# Altium project eeg.PrjPcb
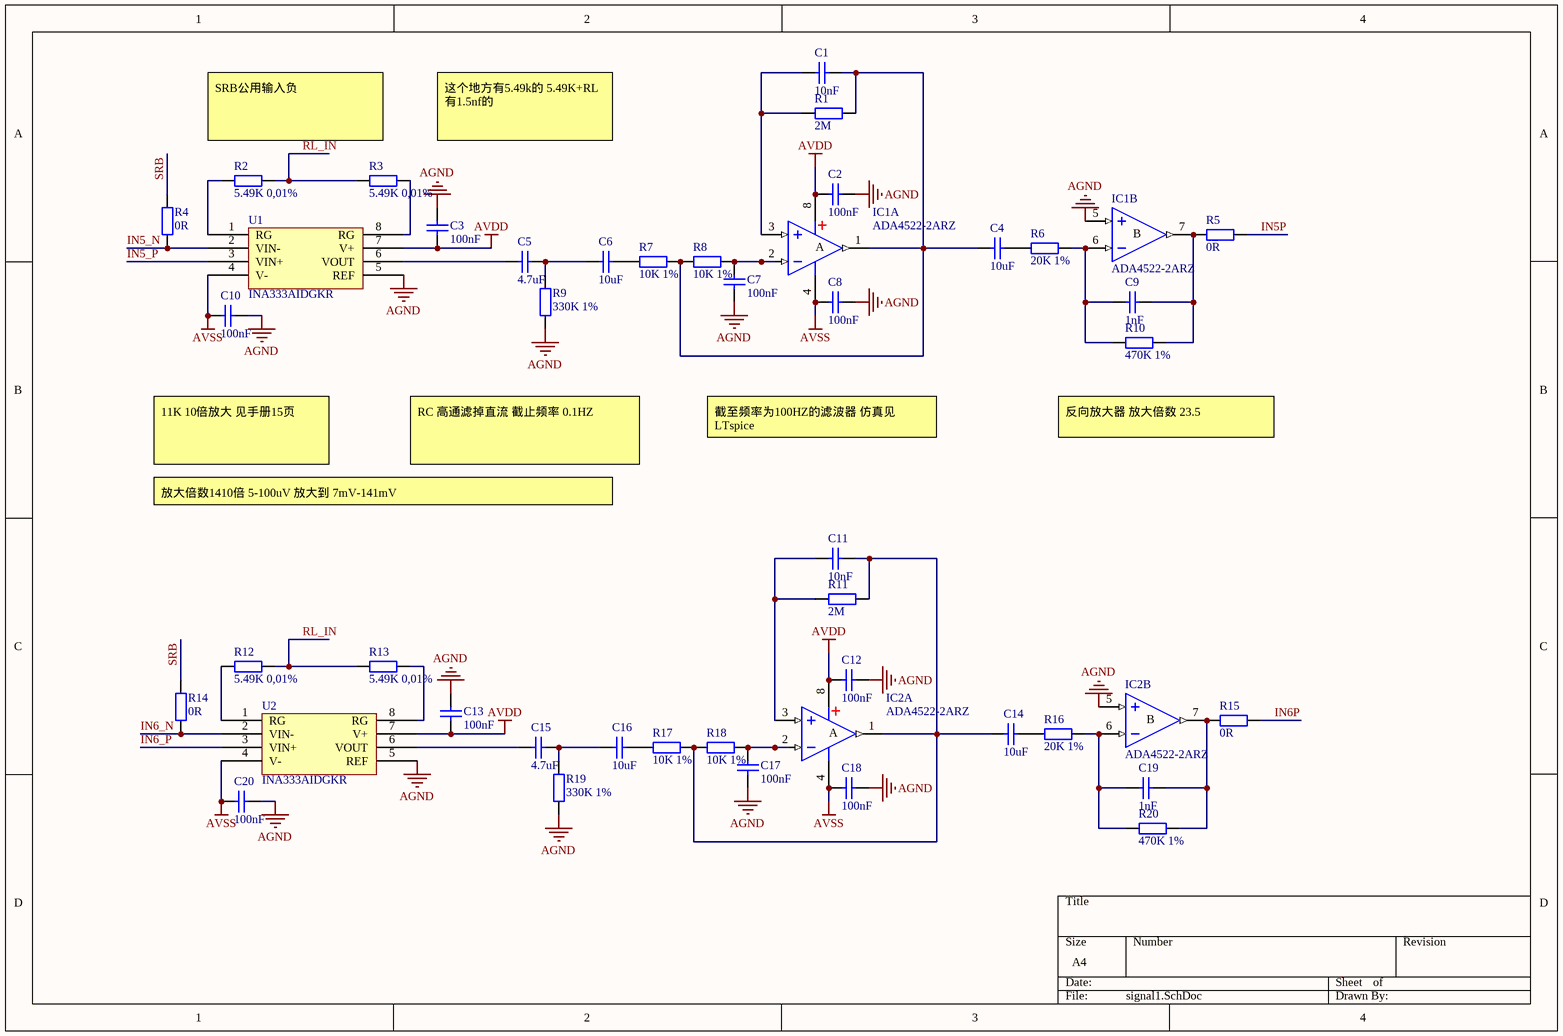
[diagram p0: signal1.SchDoc]
4 sheets, 143 parts. Net scope: global (net labels, ports and power ports of the same name join across sheets).
Board file: eeg.PcbDoc
Sheets:
  signal1.SchDoc
  signal2.SchDoc
  signal3.SchDoc
  power_ic.SchDoc

## Sheet signal1.SchDoc
size A4; SheetNumber: 1; SheetTotal: 6

### Parts
C1  10nF  [C0603_L]
C2  100nF  [C0603_L]
C3  100nF  [C0603_L]
C4  10uF  [C0603_L]
C5  4.7uF  [C0603_L]
C6  10uF  [C0603_L]
C7  100nF  [C0603_L]
C8  100nF  [C0603_L]
C9  1nF  [C0603_L]
C10  100nF  [C0603_L]
C11  10nF  [C0603_L]
C12  100nF  [C0603_L]
C13  100nF  [C0603_L]
C14  10uF  [C0603_L]
C15  4.7uF  [C0603_L]
C16  10uF  [C0603_L]
C17  100nF  [C0603_L]
C18  100nF  [C0603_L]
C19  1nF  [C0603_L]
C20  100nF  [C0603_L]
IC1  ADA4522-2ARZ  [SOIC-8]  (parts A,B of 2)
IC2  ADA4522-2ARZ  [SOIC-8]  (parts A,B of 2)
R1  2M  [R0603_L]
R2  5.49K 0,01%  [R0603_M]
R3  5.49K 0,01%  [R0603_M]
R4  0R  [R0603_L]
R5  0R  [R0603_L]
R6  20K 1%  [R0603_L]
R7  10K 1%  [R0603_L]
R8  10K 1%  [R0603_L]
R9  330K 1%  [R0603_L]
R10  470K 1%  [R0603_L]
R11  2M  [R0603_L]
R12  5.49K 0,01%  [R0603_M]
R13  5.49K 0,01%  [R0603_M]
R14  0R  [R0603_L]
R15  0R  [R0603_L]
R16  20K 1%  [R0603_L]
R17  10K 1%  [R0603_L]
R18  10K 1%  [R0603_L]
R19  330K 1%  [R0603_L]
R20  470K 1%  [R0603_L]
U1  INA333AIDGKR  [MSOP8_N]
U2  INA333AIDGKR  [MSOP8_N]

### Nets
AGND: C2.2 C3.1 C7.1 C8.2 C10.1 C12.2 C13.1 C17.1 C18.2 C20.1 IC1.5(IN+) IC2.5(IN+) R9.1 R19.1 U1.5(REF) U2.5(REF)
AVDD: C2.1 C3.2 C12.1 C13.2 IC1.8(V+) IC2.8(V+) U1.7(V+) U2.7(V+)
AVSS: C8.1 C10.2 C18.1 C20.2 IC1.4(V-) IC2.4(V-) U1.4(V-) U2.4(V-)
IN5_N: R4.2 U1.2(VIN-)
IN5_P: U1.3(VIN+)
IN5P: R5.1
IN6_N: R14.2 U2.2(VIN-)
IN6_P: U2.3(VIN+)
IN6P: R15.1
RL_IN: R2.2 R3.1 R12.2 R13.1
SRB: R4.1 R14.1
NetC1_1: C1.1 IC1.3(IN+) R1.2
NetC1_2: C1.2 C4.1 IC1.1(OUT) R1.1 R7.1 R8.2
NetC4_2: C4.2 R6.2
NetC5_1: C5.1 U1.6(VOUT)
NetC5_2: C5.2 C6.1 R9.2
NetC6_2: C6.2 R7.2
NetC7_2: C7.2 IC1.2(IN-) R8.1
NetC9_1: C9.1 IC1.6(IN-) R6.1 R10.2
NetC9_2: C9.2 IC1.7(OUT) R5.2 R10.1
NetC11_1: C11.1 IC2.3(IN+) R11.2
NetC11_2: C11.2 C14.1 IC2.1(OUT) R11.1 R17.1 R18.2
NetC14_2: C14.2 R16.2
NetC15_1: C15.1 U2.6(VOUT)
NetC15_2: C15.2 C16.1 R19.2
NetC16_2: C16.2 R17.2
NetC17_2: C17.2 IC2.2(IN-) R18.1
NetC19_1: C19.1 IC2.6(IN-) R16.1 R20.2
NetC19_2: C19.2 IC2.7(OUT) R15.2 R20.1
NetR2_1: R2.1 U1.1(RG)
NetR3_2: R3.2 U1.8(RG)
NetR12_1: R12.1 U2.1(RG)
NetR13_2: R13.2 U2.8(RG)

### Notes on the sheet
- SRB公用输入负
- 这个地方有5.49k的 5.49K+RL 有1.5nf的
- 截至频率为100HZ的滤波器 仿真见LTspice
- 反向放大器 放大倍数 23.5
- 11K 10倍放大 见手册15页
- 放大倍数1410倍 5-100uV 放大到 7mV-141mV
- RC 高通滤掉直流 截止频率 0.1HZ
- (in symbol ADA4522-2ARZ, part A) A
- (in symbol ADA4522-2ARZ, part B) B

### Library data of the parts
C1-C20 = C: 贴片电容/MLCC电容; BOM名称: 无极性贴片电容; 联系下单店铺卖家 免费帮你查找封装: 联系下单店铺卖家 免费技术指导
IC1 IC2 = ADA4522-2ARZ: 双通道55V、EMI增强型、零漂移、超低噪声、RRO运算放大器; BOM名称: 双路运放; 封装库来自淘宝卖家：黄晶宝石: 其他店铺购入均为赃物，无售后更新权益，请立即申请退款，退款后现金奖励200~1000元; jlc_id: C403697
R1-R20 = R: 贴片电阻; 联系下单店铺卖家 免费帮你查找封装: 联系下单店铺卖家 免费技术指导; BOM名称: 贴片电阻
U1 U2 = INA333AIDGKR: INA333 低功耗、零漂移、精密仪表放大器; jlc_id: C19450

## Sheet signal2.SchDoc
size A4; SheetNumber: 2; SheetTotal: 6
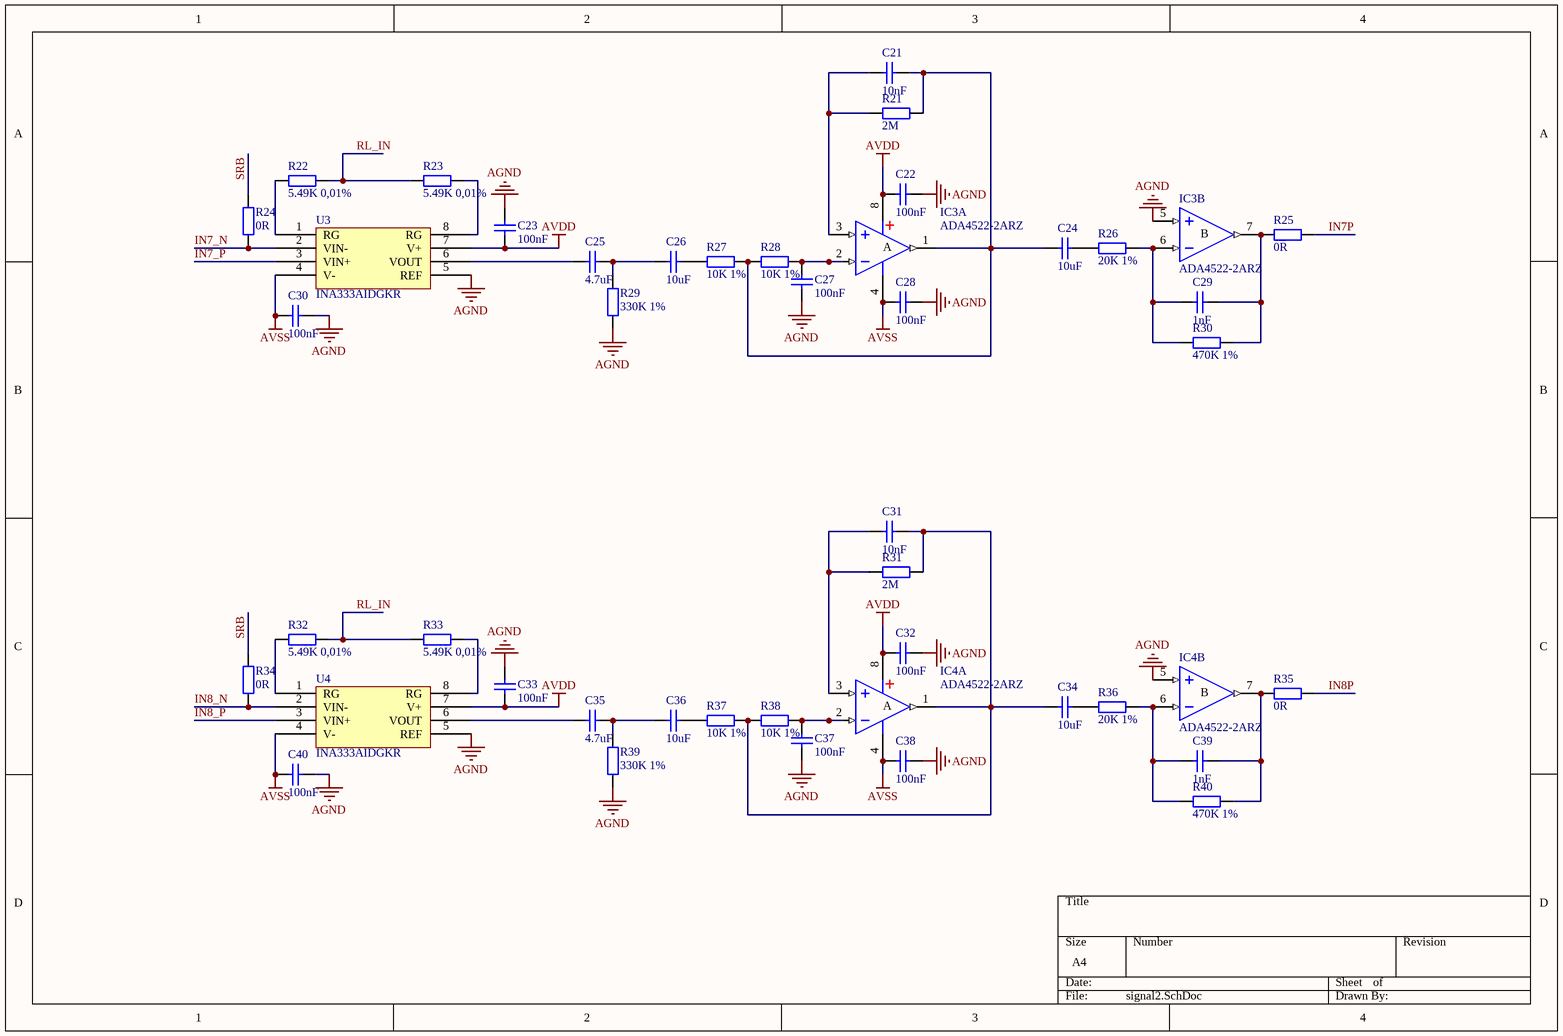
[diagram p1: signal2.SchDoc]

### Parts
C21  10nF  [C0603_L]
C22  100nF  [C0603_L]
C23  100nF  [C0603_L]
C24  10uF  [C0603_L]
C25  4.7uF  [C0603_L]
C26  10uF  [C0603_L]
C27  100nF  [C0603_L]
C28  100nF  [C0603_L]
C29  1nF  [C0603_L]
C30  100nF  [C0603_L]
C31  10nF  [C0603_L]
C32  100nF  [C0603_L]
C33  100nF  [C0603_L]
C34  10uF  [C0603_L]
C35  4.7uF  [C0603_L]
C36  10uF  [C0603_L]
C37  100nF  [C0603_L]
C38  100nF  [C0603_L]
C39  1nF  [C0603_L]
C40  100nF  [C0603_L]
IC3  ADA4522-2ARZ  [SOIC-8]  (parts A,B of 2)
IC4  ADA4522-2ARZ  [SOIC-8]  (parts A,B of 2)
R21  2M  [R0603_L]
R22  5.49K 0,01%  [R0603_M]
R23  5.49K 0,01%  [R0603_M]
R24  0R  [R0603_L]
R25  0R  [R0603_L]
R26  20K 1%  [R0603_L]
R27  10K 1%  [R0603_L]
R28  10K 1%  [R0603_L]
R29  330K 1%  [R0603_L]
R30  470K 1%  [R0603_L]
R31  2M  [R0603_L]
R32  5.49K 0,01%  [R0603_M]
R33  5.49K 0,01%  [R0603_M]
R34  0R  [R0603_L]
R35  0R  [R0603_L]
R36  20K 1%  [R0603_L]
R37  10K 1%  [R0603_L]
R38  10K 1%  [R0603_L]
R39  330K 1%  [R0603_L]
R40  470K 1%  [R0603_L]
U3  INA333AIDGKR  [MSOP8_N]
U4  INA333AIDGKR  [MSOP8_N]

### Nets
AGND: C22.2 C23.1 C27.1 C28.2 C30.1 C32.2 C33.1 C37.1 C38.2 C40.1 IC3.5(IN+) IC4.5(IN+) R29.1 R39.1 U3.5(REF) U4.5(REF)
AVDD: C22.1 C23.2 C32.1 C33.2 IC3.8(V+) IC4.8(V+) U3.7(V+) U4.7(V+)
AVSS: C28.1 C30.2 C38.1 C40.2 IC3.4(V-) IC4.4(V-) U3.4(V-) U4.4(V-)
IN7_N: R24.2 U3.2(VIN-)
IN7_P: U3.3(VIN+)
IN7P: R25.1
IN8_N: R34.2 U4.2(VIN-)
IN8_P: U4.3(VIN+)
IN8P: R35.1
RL_IN: R22.2 R23.1 R32.2 R33.1
SRB: R24.1 R34.1
NetC21_1: C21.1 IC3.3(IN+) R21.2
NetC21_2: C21.2 C24.1 IC3.1(OUT) R21.1 R27.1 R28.2
NetC24_2: C24.2 R26.2
NetC25_1: C25.1 U3.6(VOUT)
NetC25_2: C25.2 C26.1 R29.2
NetC26_2: C26.2 R27.2
NetC27_2: C27.2 IC3.2(IN-) R28.1
NetC29_1: C29.1 IC3.6(IN-) R26.1 R30.2
NetC29_2: C29.2 IC3.7(OUT) R25.2 R30.1
NetC31_1: C31.1 IC4.3(IN+) R31.2
NetC31_2: C31.2 C34.1 IC4.1(OUT) R31.1 R37.1 R38.2
NetC34_2: C34.2 R36.2
NetC35_1: C35.1 U4.6(VOUT)
NetC35_2: C35.2 C36.1 R39.2
NetC36_2: C36.2 R37.2
NetC37_2: C37.2 IC4.2(IN-) R38.1
NetC39_1: C39.1 IC4.6(IN-) R36.1 R40.2
NetC39_2: C39.2 IC4.7(OUT) R35.2 R40.1
NetR22_1: R22.1 U3.1(RG)
NetR23_2: R23.2 U3.8(RG)
NetR32_1: R32.1 U4.1(RG)
NetR33_2: R33.2 U4.8(RG)

### Notes on the sheet
- (in symbol ADA4522-2ARZ, part A) A
- (in symbol ADA4522-2ARZ, part B) B

### Library data of the parts
C21-C40 = C: as C1 on sheet signal1
IC3 IC4 = ADA4522-2ARZ: as IC1 on sheet signal1; jlc_id: C403697
R21-R40 = R: 贴片电阻; 联系下单店铺卖家 免费帮你查找封装: 联系下单店铺卖家 免费技术指导; BOM名称: 贴片电阻
U3 U4 = INA333AIDGKR: INA333 低功耗、零漂移、精密仪表放大器; jlc_id: C19450

## Sheet signal3.SchDoc
size A4; SheetNumber: 3; SheetTotal: 6
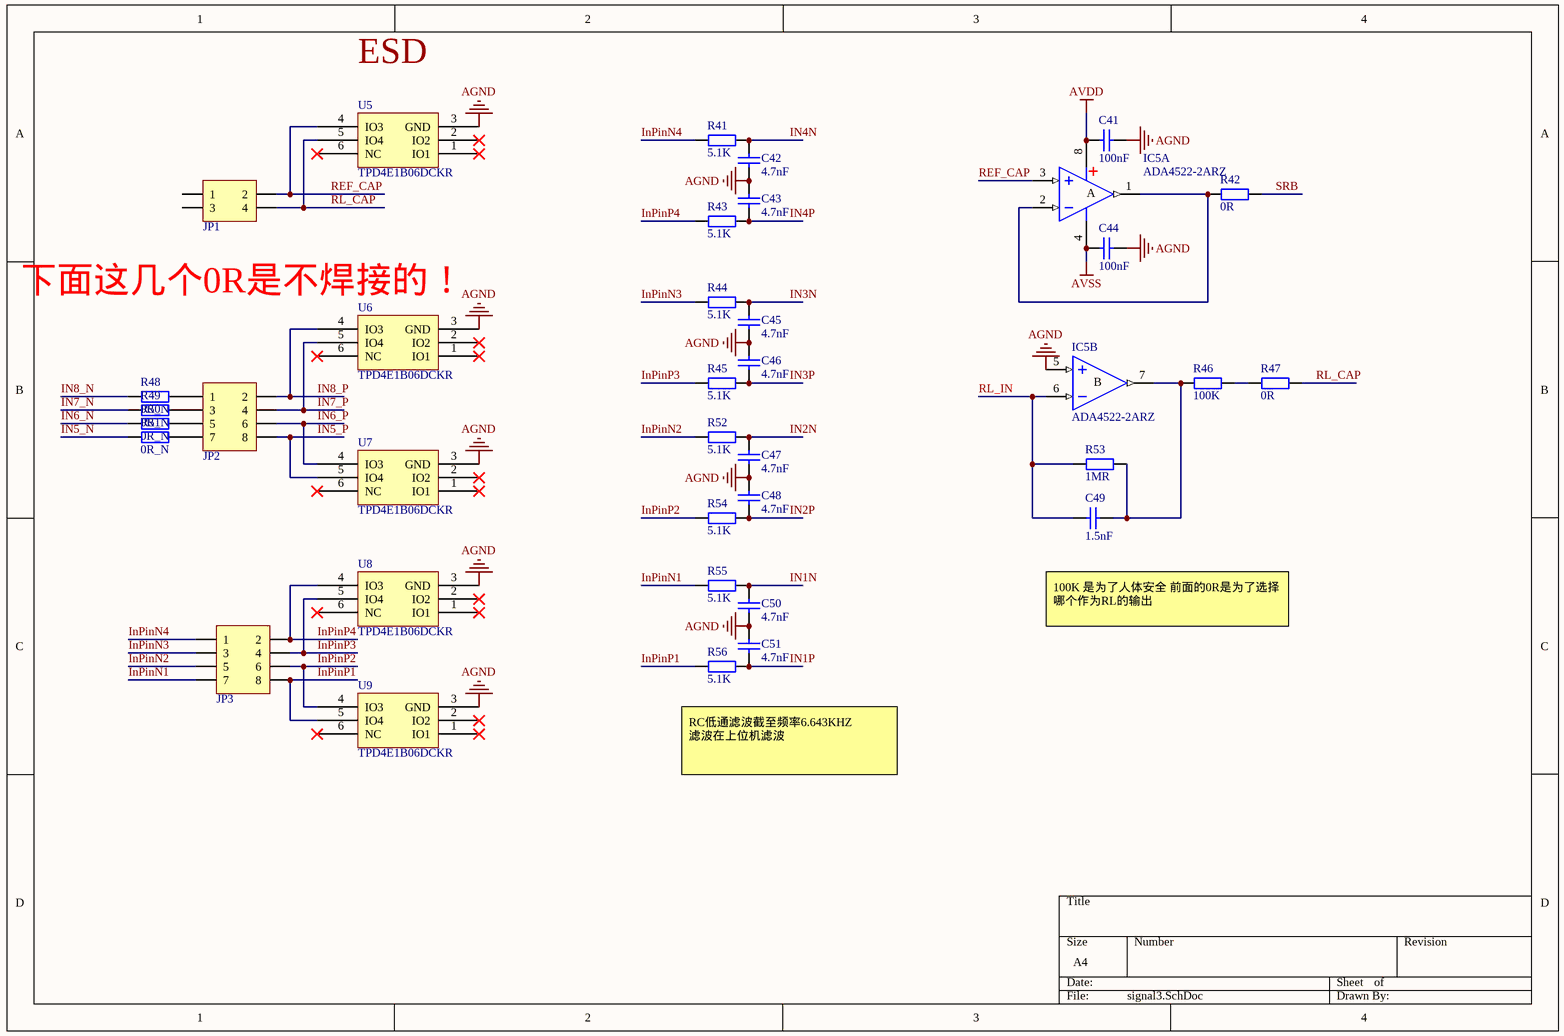
[diagram p2: signal3.SchDoc]

### Parts
C41  100nF  [C0603_L]
C42  4.7nF  [C0603_L]
C43  4.7nF  [C0603_L]
C44  100nF  [C0603_L]
C45  4.7nF  [C0603_L]
C46  4.7nF  [C0603_L]
C47  4.7nF  [C0603_L]
C48  4.7nF  [C0603_L]
C49  1.5nF  [C0603_L]
C50  4.7nF  [C0603_L]
C51  4.7nF  [C0603_L]
IC5  ADA4522-2ARZ  [SOIC-8]  (parts A,B of 2)
JP1  Header2X2  [HDR2.54-WI-2x2P]  (value not drawn)
JP2  Header 4X2  [HDR2.54-WI-2x4P]  (value not drawn)
JP3  Header 4X2  [HDR2.54-WI-2x4P]  (value not drawn)
R41  5.1K  [R0603_L]
R42  0R  [R0603_L]
R43  5.1K  [R0603_L]
R44  5.1K  [R0603_L]
R45  5.1K  [R0603_L]
R46  100K  [R0603_L]
R47  0R  [R0603_L]
R48  0R_N  [R0603_L]
R49  0R_N  [R0603_L]
R50  0R_N  [R0603_L]
R51  0R_N  [R0603_L]
R52  5.1K  [R0603_L]
R53  1MR  [R0603_L]
R54  5.1K  [R0603_L]
R55  5.1K  [R0603_L]
R56  5.1K  [R0603_L]
U5  TPD4E1B06DCKR  [SOT363_N]
U6  TPD4E1B06DCKR  [SOT363_N]
U7  TPD4E1B06DCKR  [SOT363_N]
U8  TPD4E1B06DCKR  [SOT363_N]
U9  TPD4E1B06DCKR  [SOT363_N]

### Nets
AGND: C41.2 C42.1 C43.2 C44.2 C45.1 C46.2 C47.1 C48.2 C50.1 C51.2 IC5.5(IN+) U5.3(GND) U6.3(GND) U7.3(GND) U8.3(GND) U9.3(GND)
AVDD: C41.1 IC5.8(V+)
AVSS: C44.1 IC5.4(V-)
IN1N: C50.2 R55.2
IN1P: C51.1 R56.2
IN2N: C47.2 R52.2
IN2P: C48.1 R54.2
IN3N: C45.2 R44.2
IN3P: C46.1 R45.2
IN4N: C42.2 R41.2
IN4P: C43.1 R43.2
IN5_N: R51.2
IN5_P: JP2.8 U7.5(IO4)
IN6_N: R50.2
IN6_P: JP2.6 U7.4(IO3)
IN7_N: R49.2
IN7_P: JP2.4 U6.5(IO4)
IN8_N: R48.2
IN8_P: JP2.2 U6.4(IO3)
InPinN1: JP3.7 R55.1
InPinN2: JP3.5 R52.1
InPinN3: JP3.3 R44.1
InPinN4: JP3.1 R41.1
InPinP1: JP3.8 R56.1 U9.5(IO4)
InPinP2: JP3.6 R54.1 U9.4(IO3)
InPinP3: JP3.4 R45.1 U8.5(IO4)
InPinP4: JP3.2 R43.1 U8.4(IO3)
REF_CAP: IC5.3(IN+) JP1.2 U5.4(IO3)
RL_CAP: JP1.4 R47.1 U5.5(IO4)
RL_IN: C49.1 IC5.6(IN-) R53.2
SRB: R42.1
NetC49_2: C49.2 IC5.7(OUT) R46.2 R53.1
NetIC5_1: IC5.1(OUT) IC5.2(IN-) R42.2
NetJP2_1: JP2.1 R48.1
NetJP2_3: JP2.3 R49.1
NetJP2_5: JP2.5 R50.1
NetJP2_7: JP2.7 R51.1
NetR46_1: R46.1 R47.2

Not connected (* = marked no-connect by the designer): JP1 1 3; U5 1(IO1)* 2(IO2)* 6(NC)*; U6 1(IO1)* 2(IO2)* 6(NC)*; U7 1(IO1)* 2(IO2)* 6(NC)*; U8 1(IO1)* 2(IO2)* 6(NC)*; U9 1(IO1)* 2(IO2)* 6(NC)*

### Notes on the sheet
- ESD
- 下面这几个0R是不焊接的！
- 100K 是为了人体安全 前面的0R是为了选择哪个作为RL的输出
- RC低通滤波截至频率6.643KHZ
  滤波在上位机滤波
- (in symbol ADA4522-2ARZ, part A) A
- (in symbol ADA4522-2ARZ, part B) B

### Library data of the parts
C41-C51 = C: as C1 on sheet signal1
IC5 = ADA4522-2ARZ: as IC1 on sheet signal1; jlc_id: C403697
JP1 = Header 2X2: 2*2P接插件; 联系卖家，免费查找封装: 唯一出售店铺网址https://shop463601444.taobao.com; 封装库来自淘宝卖家ID：黄晶宝石: 其他店铺购入均为盗版封装库，请立即申请退款，本店现金奖励50~200元; BOM名称: 2*2P接插件
JP2 JP3 = Header 4X2: 4*2P接插件; 联系卖家，免费查找封装: 唯一出售店铺网址https://shop463601444.taobao.com; 封装库来自淘宝卖家ID：黄晶宝石: 其他店铺购入均为盗版封装库，请立即申请退款，本店现金奖励50~200元; BOM名称: 4*2P接插件
R41-R56 = R: 贴片电阻; 联系下单店铺卖家 免费帮你查找封装: 联系下单店铺卖家 免费技术指导; BOM名称: 贴片电阻
U5-U9 = TPD4E1B06DCKR: 具有 0.5nA 最大泄漏电流的四路 0.7pF、±5.5V、±12kV ESD 保护二极管; jlc_id: C840093

## Sheet power_ic.SchDoc
size A4; SheetNumber: 6; SheetTotal: 6
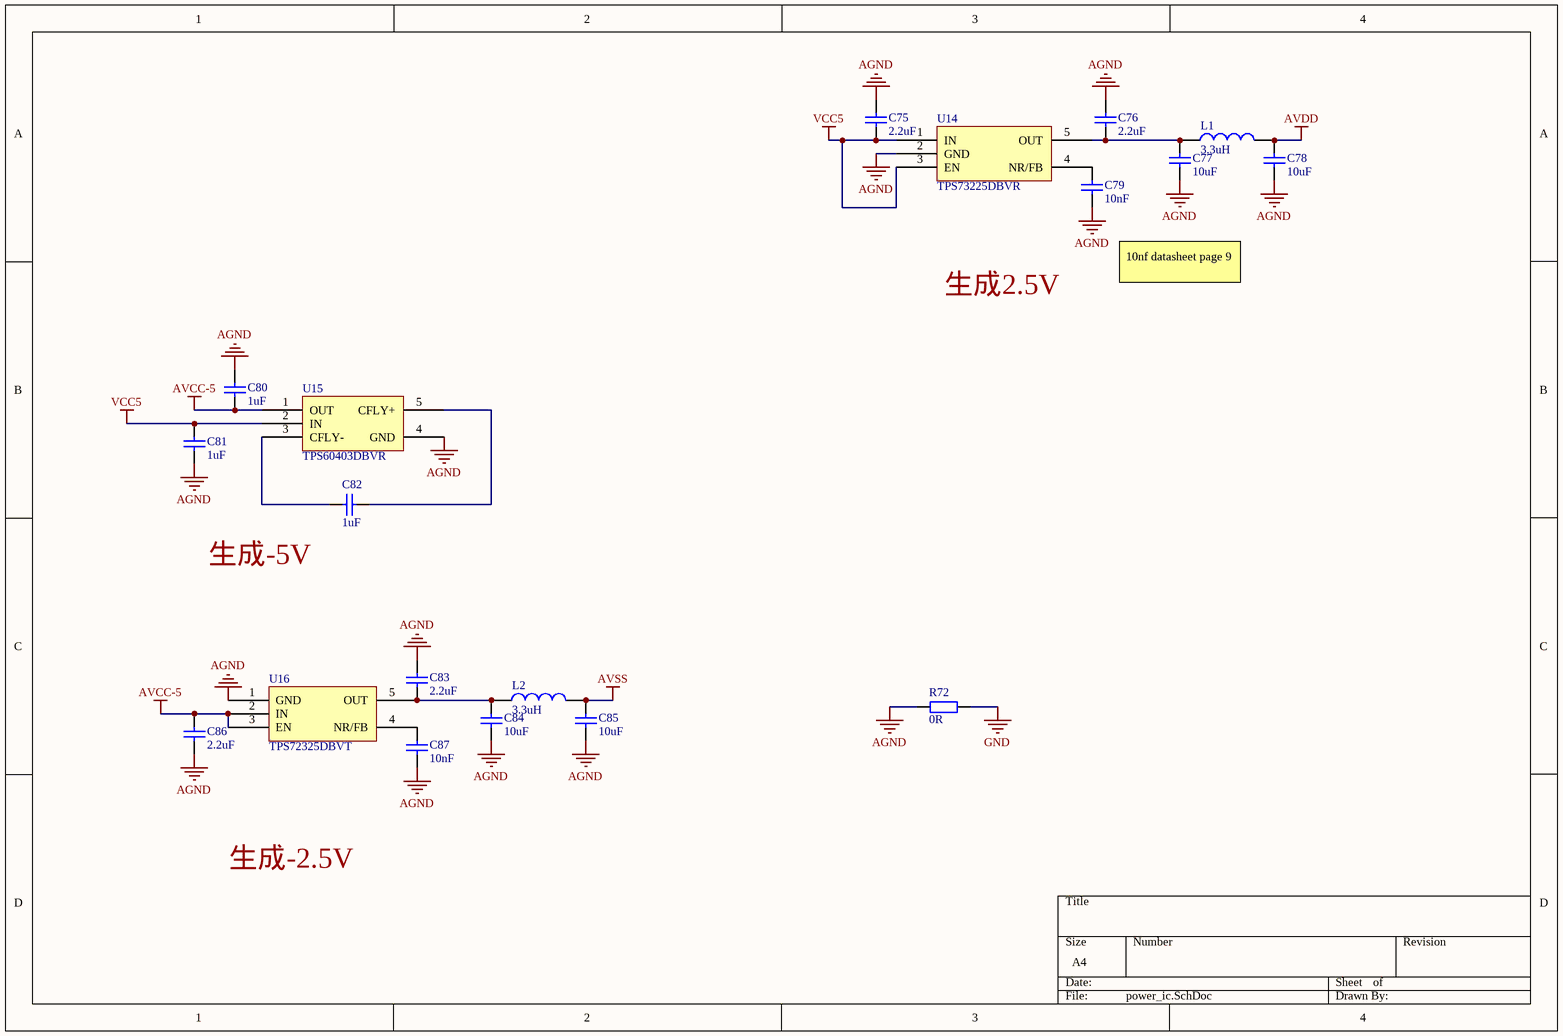
[diagram p3: power_ic.SchDoc]

### Parts
C75  2.2uF  [C0603_L]
C76  2.2uF  [C0603_L]
C77  10uF  [C0603_L]
C78  10uF  [C0603_L]
C79  10nF  [C0603_L]
C80  1uF  [C0603_L]
C81  1uF  [C0603_L]
C82  1uF  [C0603_L]
C83  2.2uF  [C0603_L]
C84  10uF  [C0603_L]
C85  10uF  [C0603_L]
C86  2.2uF  [C0603_L]
C87  10nF  [C0603_L]
L1  3.3uH  [L0805]
L2  3.3uH  [L0805]
R72  0R  [R1206_L]
U14  TPS73225DBVR  [SOT23-5]
U15  TPS60403DBVR  [SOT23-5]
U16  TPS72325DBVT  [SOT23-5]

### Nets
AGND: C75.1 C76.1 C77.2 C78.2 C79.2 C80.2 C81.1 C83.1 C84.2 C85.2 C86.1 C87.2 R72.1 U14.2(GND) U15.4(GND) U16.1(GND)
AVCC-5: C80.1 C86.2 U15.1(OUT) U16.2(IN) U16.3(EN)
AVDD: C78.1 L1.2
AVSS: C85.1 L2.2
GND: R72.2
VCC5: C75.2 C81.2 U14.1(IN) U14.3(EN) U15.2(IN)
NetC76_2: C76.2 C77.1 L1.1 U14.5(OUT)
NetC79_1: C79.1 U14.4(NR/FB)
NetC82_1: C82.1 U15.3(CFLY-)
NetC82_2: C82.2 U15.5(CFLY+)
NetC83_2: C83.2 C84.1 L2.1 U16.5(OUT)
NetC87_1: C87.1 U16.4(NR/FB)

### Notes on the sheet
- 生成2.5V
- 10nf datasheet page 9
- 生成-5V
- 生成-2.5V

### Library data of the parts
C75-C87 = C: as C1 on sheet signal1
L1 L2 = L: 贴片小功率电感; BOM名称: 小功率贴片电感; 联系下单店铺卖家 免费帮你查找封装: 联系下单店铺卖家 免费技术指导; jlc_id: C162585
R72 = R: 贴片电阻; 联系下单店铺卖家 免费帮你查找封装: 联系下单店铺卖家 免费技术指导; BOM名称: 贴片电阻
U14 = TPS73225DBVR: 2.5V输出LDO 30uVRMS 精度1%
U15 = TPS60403DBVR: 60mA 充电泵电压反向器 250khz
U16 = TPS72325DBVT: 200mA 负输出低压降线性稳压器 5-SOT-23 -40 to 125; jlc_id: C2864241

## Nets that join several sheets
AGND: signal1 (16 pins), signal2 (16 pins), signal3 (16 pins), power_ic (16 pins)
AVDD: signal1 (8 pins), signal2 (8 pins), signal3 (C41.1 IC5.8), power_ic (C78.1 L1.2)
AVSS: signal1 (8 pins), signal2 (8 pins), signal3 (C44.1 IC5.4), power_ic (C85.1 L2.2)
IN5_N: signal1 (R4.2 U1.2), signal3 (R51.2)
IN5_P: signal1 (U1.3), signal3 (JP2.8 U7.5)
IN6_N: signal1 (R14.2 U2.2), signal3 (R50.2)
IN6_P: signal1 (U2.3), signal3 (JP2.6 U7.4)
IN7_N: signal2 (R24.2 U3.2), signal3 (R49.2)
IN7_P: signal2 (U3.3), signal3 (JP2.4 U6.5)
IN8_N: signal2 (R34.2 U4.2), signal3 (R48.2)
IN8_P: signal2 (U4.3), signal3 (JP2.2 U6.4)
RL_IN: signal1 (R2.2 R3.1 R12.2 R13.1), signal2 (R22.2 R23.1 R32.2 R33.1), signal3 (C49.1 IC5.6 R53.2)
SRB: signal1 (R4.1 R14.1), signal2 (R24.1 R34.1), signal3 (R42.1)